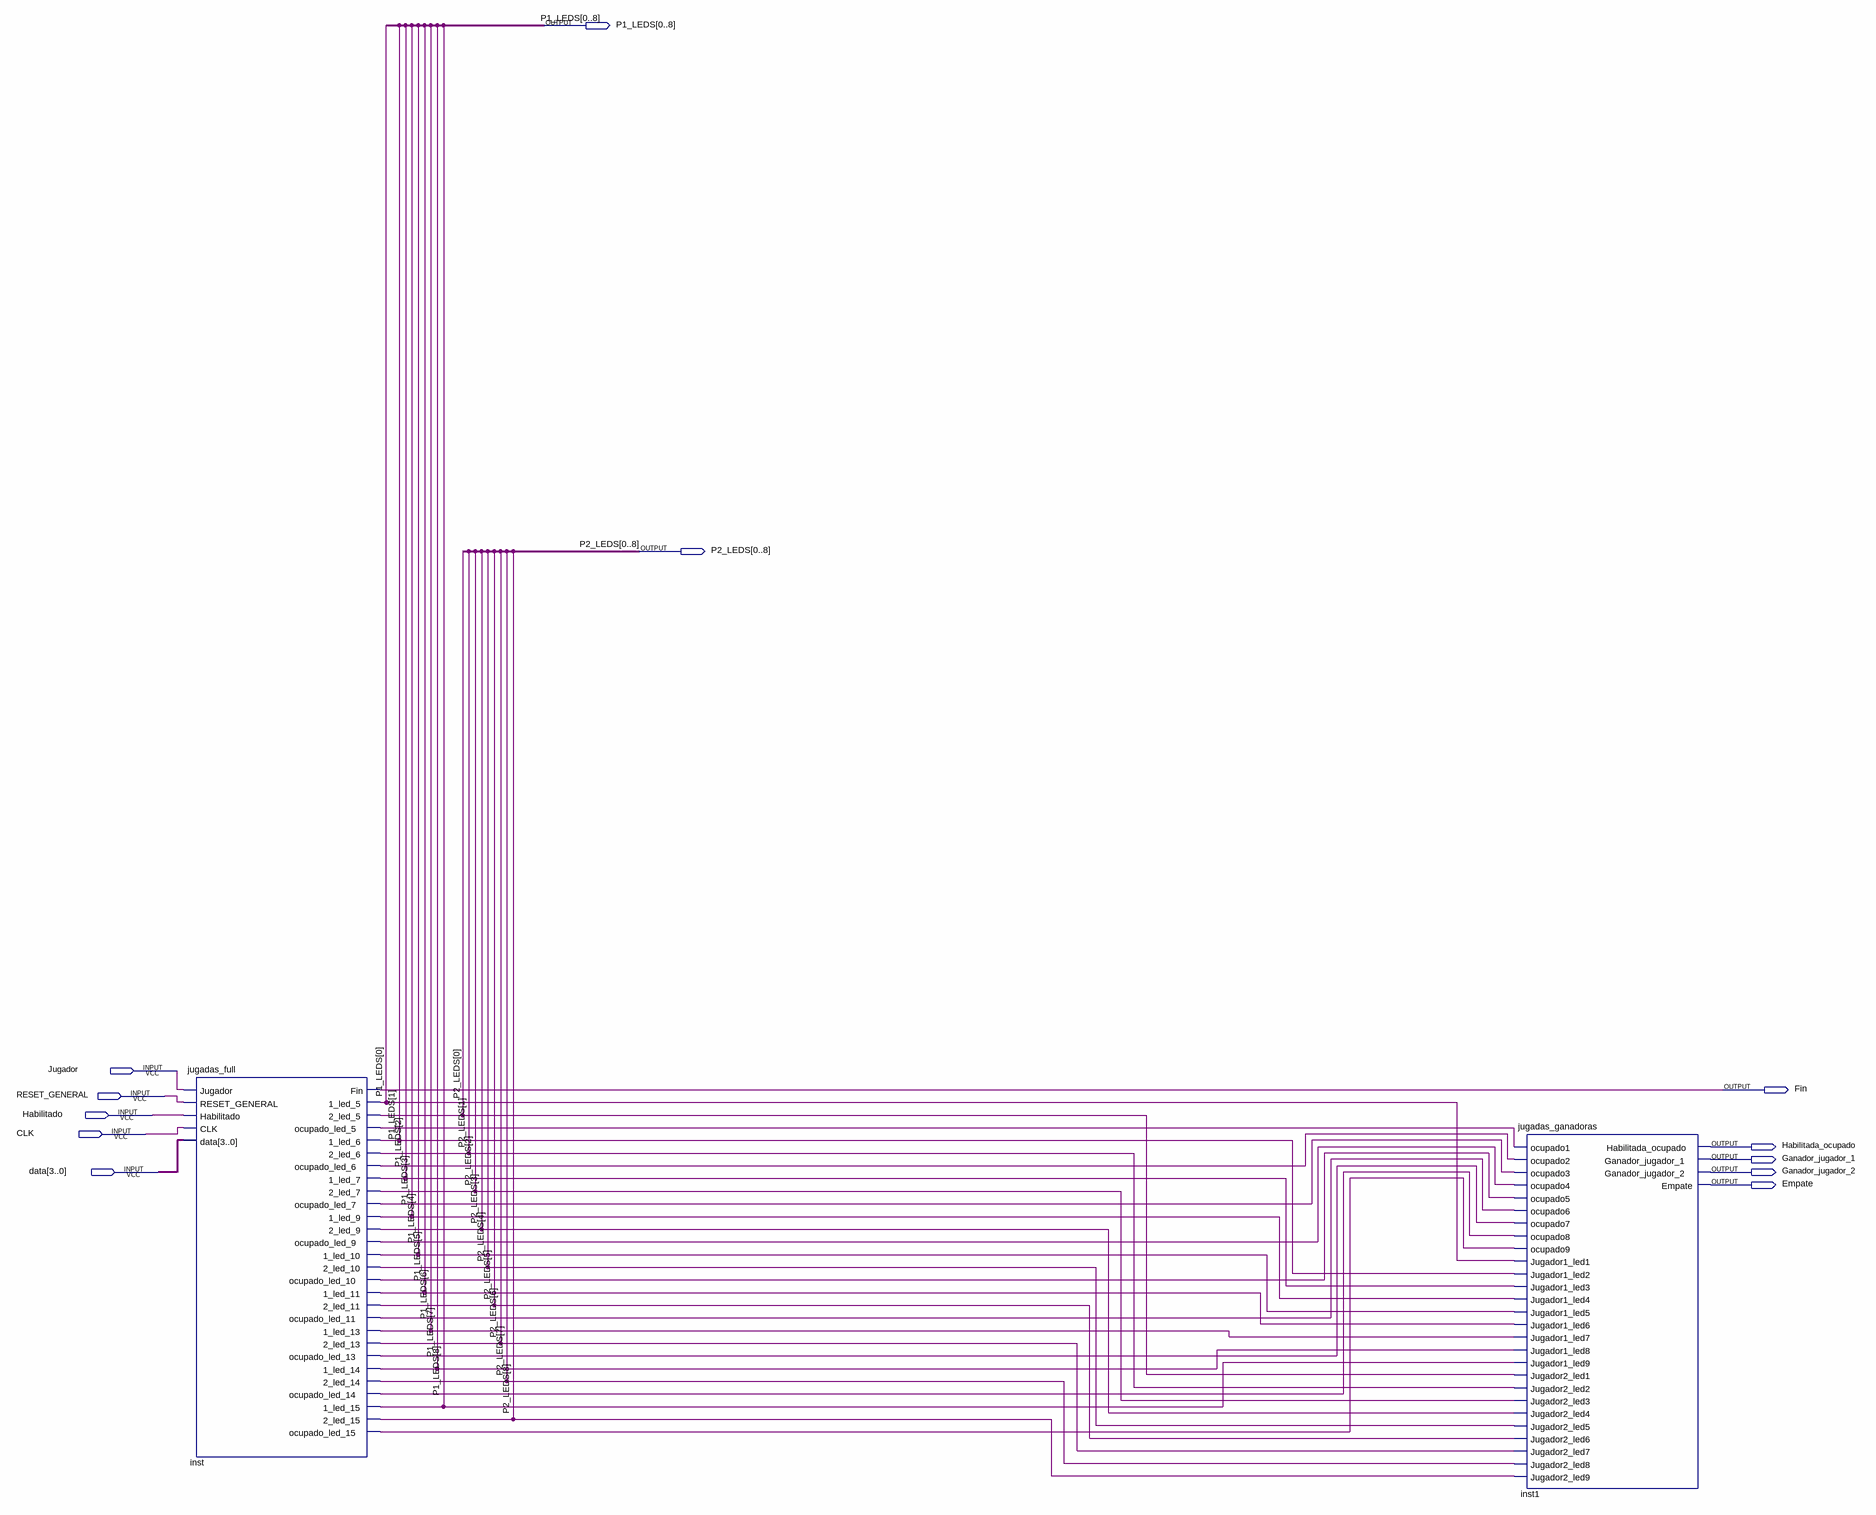
[diagram p0: schematic sheet]
// Quartus schematic Bloque_final.bdf as structural Verilog: 2 symbols, 12 pins
module Bloque_final (
  input  Jugador,
  input  RESET_GENERAL,
  input  Habilitado,
  input  CLK,
  input  [3:0] data,
  output [0:8] P1_LEDS,
  output [0:8] P2_LEDS,
  output Fin,
  output Habilitada_ocupado,
  output Ganador_jugador_1,
  output Ganador_jugador_2,
  output Empate
);

  wire inst_ocupado_led_5, inst_ocupado_led_6, inst_ocupado_led_7, inst_ocupado_led_9, inst_ocupado_led_10,
       inst_ocupado_led_11, inst_ocupado_led_13, inst_ocupado_led_14, inst_ocupado_led_15;

  jugadas_full inst (
    .Jugador(Jugador), .RESET_GENERAL(RESET_GENERAL), .Habilitado(Habilitado), .CLK(CLK), .data(data),
    .Fin(Fin), .\1_led_5 (P1_LEDS[0]), .\2_led_5 (P2_LEDS[0]), .ocupado_led_5(inst_ocupado_led_5),
    .\1_led_6 (P1_LEDS[1]), .\2_led_6 (P2_LEDS[1]), .ocupado_led_6(inst_ocupado_led_6),
    .\1_led_7 (P1_LEDS[2]), .\2_led_7 (P2_LEDS[2]), .ocupado_led_7(inst_ocupado_led_7),
    .\1_led_9 (P1_LEDS[3]), .\2_led_9 (P2_LEDS[3]), .ocupado_led_9(inst_ocupado_led_9),
    .\1_led_10 (P1_LEDS[4]), .\2_led_10 (P2_LEDS[4]), .ocupado_led_10(inst_ocupado_led_10),
    .\1_led_11 (P1_LEDS[5]), .\2_led_11 (P2_LEDS[5]), .ocupado_led_11(inst_ocupado_led_11),
    .\1_led_13 (P1_LEDS[6]), .\2_led_13 (P2_LEDS[6]), .ocupado_led_13(inst_ocupado_led_13),
    .\1_led_14 (P1_LEDS[7]), .\2_led_14 (P2_LEDS[7]), .ocupado_led_14(inst_ocupado_led_14),
    .\1_led_15 (P1_LEDS[8]), .\2_led_15 (P2_LEDS[8]), .ocupado_led_15(inst_ocupado_led_15));
  jugadas_ganadoras inst1 (
    .ocupado1(inst_ocupado_led_5), .ocupado2(inst_ocupado_led_6), .ocupado3(inst_ocupado_led_7),
    .ocupado4(inst_ocupado_led_9), .ocupado5(inst_ocupado_led_10), .ocupado6(inst_ocupado_led_11),
    .ocupado7(inst_ocupado_led_13), .ocupado8(inst_ocupado_led_14), .ocupado9(inst_ocupado_led_15),
    .Jugador1_led1(P1_LEDS[0]), .Jugador1_led2(P1_LEDS[1]), .Jugador1_led3(P1_LEDS[2]),
    .Jugador1_led4(P1_LEDS[3]), .Jugador1_led5(P1_LEDS[4]), .Jugador1_led6(P1_LEDS[5]),
    .Jugador1_led7(P1_LEDS[6]), .Jugador1_led8(P1_LEDS[7]), .Jugador1_led9(P1_LEDS[8]),
    .Jugador2_led1(P2_LEDS[0]), .Jugador2_led2(P2_LEDS[1]), .Jugador2_led3(P2_LEDS[2]),
    .Jugador2_led4(P2_LEDS[3]), .Jugador2_led5(P2_LEDS[4]), .Jugador2_led6(P2_LEDS[5]),
    .Jugador2_led7(P2_LEDS[6]), .Jugador2_led8(P2_LEDS[7]), .Jugador2_led9(P2_LEDS[8]),
    .Habilitada_ocupado(Habilitada_ocupado), .Ganador_jugador_1(Ganador_jugador_1),
    .Ganador_jugador_2(Ganador_jugador_2), .Empate(Empate));
endmodule
